# Altium project VI.595X5.V1.1.PrjPcb
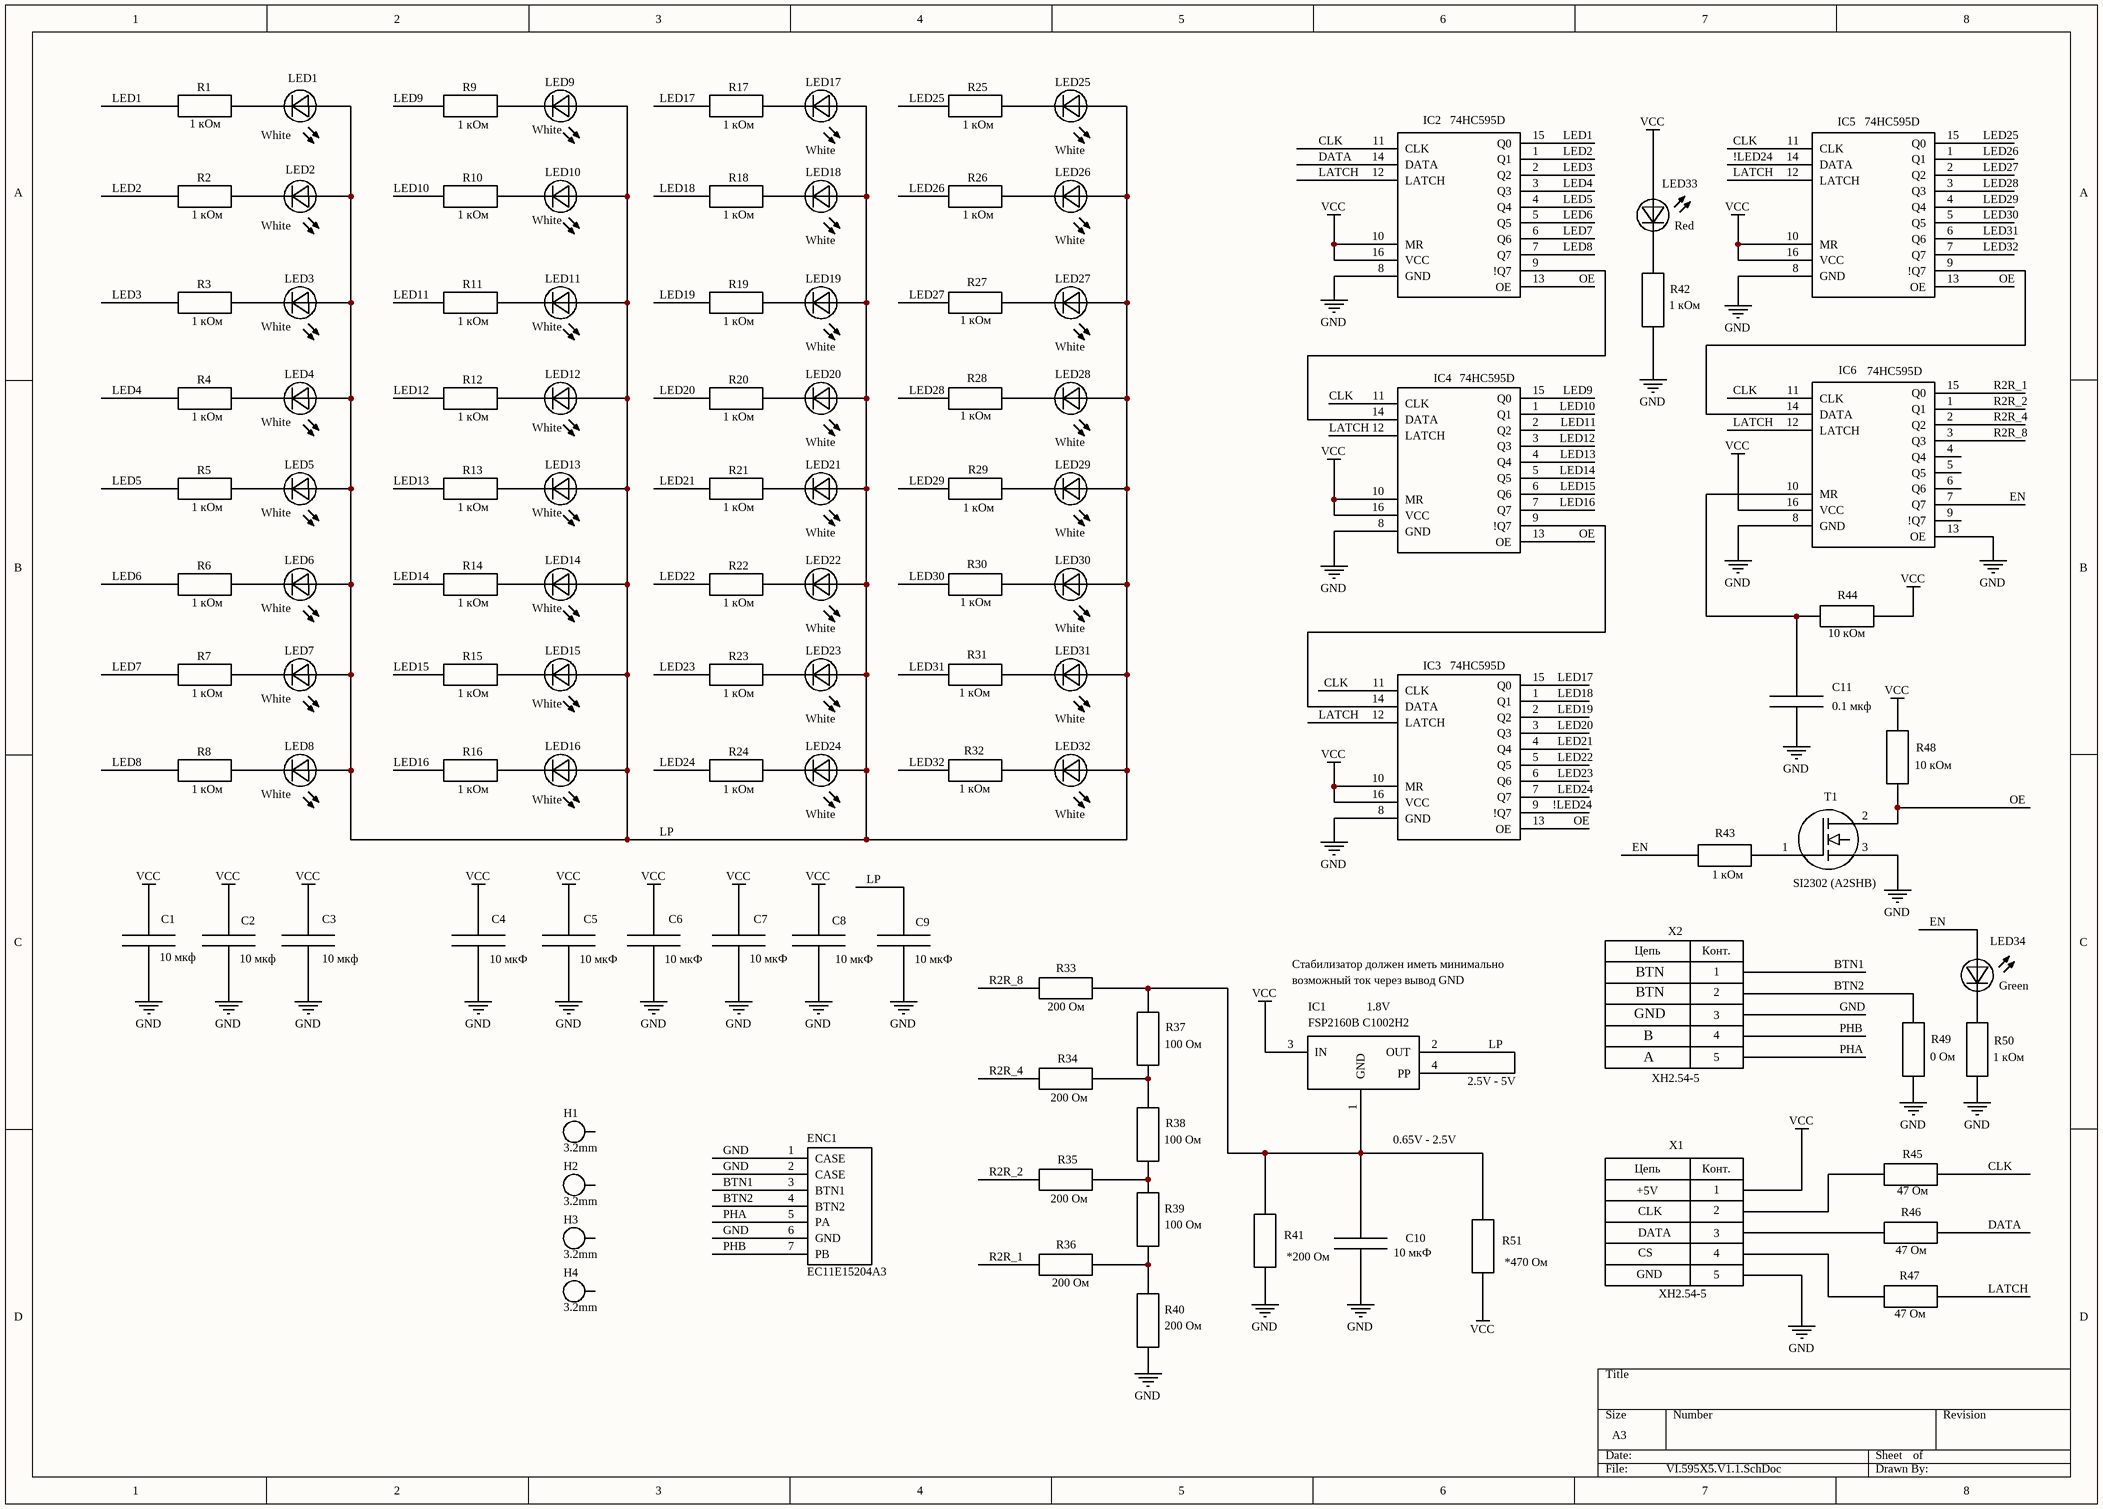
[diagram p0: VI.595X5.V1.1.SchDoc]
1 sheet, 110 parts. Net scope: global (net labels, ports and power ports of the same name join across sheets).
Board file: VI.595X5.V1.1.PcbDoc

## Sheet VI.595X5.V1.1.SchDoc: Volume_LED_indicator
size A3; Author: Sergiy_83

### Parts
C1  10 мкф  [Конденсатор SMD Case 1206]
C2  10 мкф  [Конденсатор SMD Case 1206]
C3  10 мкф  [Конденсатор SMD Case 1206]
C4  10 мкФ  [Конденсатор SMD Case 1206]
C5  10 мкФ  [Конденсатор SMD Case 1206]
C6  10 мкФ  [Конденсатор SMD Case 1206]
C7  10 мкФ  [Конденсатор SMD Case 1206]
C8  10 мкФ  [Конденсатор SMD Case 1206]
C9  10 мкФ  [Конденсатор SMD Case 1206]
C10  10 мкФ  [Конденсатор SMD Case 1206]
C11  0.1 мкф  [Конденсатор SMD Case 1206]
ENC1  EC11E15204A3  [Encoder]
H1  3.2mm  [Отверстие 3,2]
H2  3.2mm  [Отверстие 3,2]
H3  3.2mm  [Отверстие 3,2]
H4  3.2mm  [Отверстие 3,2]
IC1  FSP2160B C1002H2  [SOT-223]
IC2  74HC595D  [SO-16]
IC3  74HC595D  [SO-16]
IC4  74HC595D  [SO-16]
IC5  74HC595D  [SO-16]
IC6  74HC595D  [SO-16]
LED1  White  [Светодиод  5x2 mm]
LED2  White  [Светодиод  5x2 mm]
LED3  White  [Светодиод  5x2 mm]
LED4  White  [Светодиод  5x2 mm]
LED5  White  [Светодиод  5x2 mm]
LED6  White  [Светодиод  5x2 mm]
LED7  White  [Светодиод  5x2 mm]
LED8  White  [Светодиод  5x2 mm]
LED9  White  [Светодиод  5x2 mm]
LED10  White  [Светодиод  5x2 mm]
LED11  White  [Светодиод  5x2 mm]
LED12  White  [Светодиод  5x2 mm]
LED13  White  [Светодиод  5x2 mm]
LED14  White  [Светодиод  5x2 mm]
LED15  White  [Светодиод  5x2 mm]
LED16  White  [Светодиод  5x2 mm]
LED17  White  [Светодиод  5x2 mm]
LED18  White  [Светодиод  5x2 mm]
LED19  White  [Светодиод  5x2 mm]
LED20  White  [Светодиод  5x2 mm]
LED21  White  [Светодиод  5x2 mm]
LED22  White  [Светодиод  5x2 mm]
LED23  White  [Светодиод  5x2 mm]
LED24  White  [Светодиод  5x2 mm]
LED25  White  [Светодиод  5x2 mm]
LED26  White  [Светодиод  5x2 mm]
LED27  White  [Светодиод  5x2 mm]
LED28  White  [Светодиод  5x2 mm]
LED29  White  [Светодиод  5x2 mm]
LED30  White  [Светодиод  5x2 mm]
LED31  White  [Светодиод  5x2 mm]
LED32  White  [Светодиод  5x2 mm]
LED33  Red  [SMD 1206 Светодиод ВАЙТ]
LED34  Green  [SMD 1206 Светодиод ВАЙТ]
R1  1 кОм  [SMD 0805 Резистор]
R2  1 кОм  [SMD 0805 Резистор]
R3  1 кОм  [SMD 0805 Резистор]
R4  1 кОм  [SMD 0805 Резистор]
R5  1 кОм  [SMD 0805 Резистор]
R6  1 кОм  [SMD 0805 Резистор]
R7  1 кОм  [SMD 0805 Резистор]
R8  1 кОм  [SMD 0805 Резистор]
R9  1 кОм  [SMD 0805 Резистор]
R10  1 кОм  [SMD 0805 Резистор]
R11  1 кОм  [SMD 0805 Резистор]
R12  1 кОм  [SMD 0805 Резистор]
R13  1 кОм  [SMD 0805 Резистор]
R14  1 кОм  [SMD 0805 Резистор]
R15  1 кОм  [SMD 0805 Резистор]
R16  1 кОм  [SMD 0805 Резистор]
R17  1 кОм  [SMD 0805 Резистор]
R18  1 кОм  [SMD 0805 Резистор]
R19  1 кОм  [SMD 0805 Резистор]
R20  1 кОм  [SMD 0805 Резистор]
R21  1 кОм  [SMD 0805 Резистор]
R22  1 кОм  [SMD 0805 Резистор]
R23  1 кОм  [SMD 0805 Резистор]
R24  1 кОм  [SMD 0805 Резистор]
R25  1 кОм  [SMD 0805 Резистор]
R26  1 кОм  [SMD 0805 Резистор]
R27  1 кОм  [SMD 0805 Резистор]
R28  1 кОм  [SMD 0805 Резистор]
R29  1 кОм  [SMD 0805 Резистор]
R30  1 кОм  [SMD 0805 Резистор]
R31  1 кОм  [SMD 0805 Резистор]
R32  1 кОм  [SMD 0805 Резистор]
R33  200 Ом  [SMD 0805 Резистор]
R34  200 Ом  [SMD 0805 Резистор]
R35  200 Ом  [SMD 0805 Резистор]
R36  200 Ом  [SMD 0805 Резистор]
R37  100 Ом  [SMD 0805 Резистор]
R38  100 Ом  [SMD 0805 Резистор]
R39  100 Ом  [SMD 0805 Резистор]
R40  200 Ом  [SMD 0805 Резистор]
R41  *200 Ом  [SMD 0805 Резистор]
R42  1 кОм  [SMD 0805 Резистор]
R43  1 кОм  [SMD 0805 Резистор]
R44  10 кОм  [SMD 0805 Резистор]
R45  47 Ом  [SMD 0805 Резистор]
R46  47 Ом  [SMD 0805 Резистор]
R47  47 Ом  [SMD 0805 Резистор]
R48  10 кОм  [SMD 0805 Резистор]
R49  0 Ом  [SMD 0805 Резистор]
R50  1 кОм  [SMD 0805 Резистор]
R51  *470 Ом  [SMD 0805 Резистор]
T1  SI2302 (A2SHB)  [SMD SOT-23 Транзистор 3 pin]
X1  XH2.54-5  [(1x5)pin XH 2.54 Header]
X2  XH2.54-5  [(1x5)pin XH 2.54 Header]

### Nets
GND: C1.2(-) C2.2(-) C3.2(-) C4.2(-) C5.2(-) C6.2(-) C7.2(-) C8.2(-) C9.2(-) C10.2(-) C11.2(-) ENC1.1(CASE) ENC1.2(CASE) ENC1.6(GND) IC2.8(GND) IC3.8(GND) IC4.8(GND) IC5.8(GND) IC6.8(GND) IC6.13(OE) R40.1(left) R41.1(left) R42.1(left) R49.1(left) R50.1(left) T1.3 X1.5 X2.3
VCC: C1.1(+) C2.1(+) C3.1(+) C4.1(+) C5.1(+) C6.1(+) C7.1(+) C8.1(+) IC1.3(IN) IC2.10(MR) IC2.16(VCC) IC3.10(MR) IC3.16(VCC) IC4.10(MR) IC4.16(VCC) IC5.10(MR) IC5.16(VCC) IC6.16(VCC) LED33.1(А) R44.1(left) R48.1(left) R51.1(left) X1.1
!LED24: IC3.9(!Q7) IC5.14(DATA)
BTN1: ENC1.3(BTN1) X2.1
BTN2: ENC1.4(BTN2) R49.2(right) X2.2
CLK: IC2.11(CLK) IC3.11(CLK) IC4.11(CLK) IC5.11(CLK) IC6.11(CLK) R45.1(left)
DATA: IC2.14(DATA) R46.1(left)
EN: IC6.7(Q7) LED34.1(А) R43.2(right)
LATCH: IC2.12(LATCH) IC3.12(LATCH) IC4.12(LATCH) IC5.12(LATCH) IC6.12(LATCH) R47.1(left)
LED1: IC2.15(Q0) R1.1(left)
LED2: IC2.1(Q1) R2.1(left)
LED3: IC2.2(Q2) R3.1(left)
LED4: IC2.3(Q3) R4.1(left)
LED5: IC2.4(Q4) R5.1(left)
LED6: IC2.5(Q5) R6.1(left)
LED7: IC2.6(Q6) R7.1(left)
LED8: IC2.7(Q7) R8.1(left)
LED9: IC4.15(Q0) R9.1(left)
LED10: IC4.1(Q1) R10.1(left)
LED11: IC4.2(Q2) R11.1(left)
LED12: IC4.3(Q3) R12.1(left)
LED13: IC4.4(Q4) R13.1(left)
LED14: IC4.5(Q5) R14.1(left)
LED15: IC4.6(Q6) R15.1(left)
LED16: IC4.7(Q7) R16.1(left)
LED17: IC3.15(Q0) R17.1(left)
LED18: IC3.1(Q1) R18.1(left)
LED19: IC3.2(Q2) R19.1(left)
LED20: IC3.3(Q3) R20.1(left)
LED21: IC3.4(Q4) R21.1(left)
LED22: IC3.5(Q5) R22.1(left)
LED23: IC3.6(Q6) R23.1(left)
LED24: IC3.7(Q7) R24.1(left)
LED25: IC5.15(Q0) R25.1(left)
LED26: IC5.1(Q1) R26.1(left)
LED27: IC5.2(Q2) R27.1(left)
LED28: IC5.3(Q3) R28.1(left)
LED29: IC5.4(Q4) R29.1(left)
LED30: IC5.5(Q5) R30.1(left)
LED31: IC5.6(Q6) R31.1(left)
LED32: IC5.7(Q7) R32.1(left)
LP: C9.1(+) IC1.2(OUT) IC1.4(PP) LED1.1(А) LED2.1(А) LED3.1(А) LED4.1(А) LED5.1(А) LED6.1(А) LED7.1(А) LED8.1(А) LED9.1(А) LED10.1(А) LED11.1(А) LED12.1(А) LED13.1(А) LED14.1(А) LED15.1(А) LED16.1(А) LED17.1(А) LED18.1(А) LED19.1(А) LED20.1(А) LED21.1(А) LED22.1(А) LED23.1(А) LED24.1(А) LED25.1(А) LED26.1(А) LED27.1(А) LED28.1(А) LED29.1(А) LED30.1(А) LED31.1(А) LED32.1(А)
OE: IC2.13(OE) IC3.13(OE) IC4.13(OE) IC5.13(OE) R48.2(right) T1.2
PHA: ENC1.5(PA) X2.5
PHB: ENC1.7(PB) X2.4
R2R_1: IC6.15(Q0) R36.1(left)
R2R_2: IC6.1(Q1) R35.1(left)
R2R_4: IC6.2(Q2) R34.1(left)
R2R_8: IC6.3(Q3) R33.1(left)
NetC10_1: C10.1(+) IC1.1(GND) R33.2(right) R37.2(right) R41.2(right) R51.2(right)
NetC11_1: C11.1(+) IC6.10(MR) R44.2(right)
NetIC2_9: IC2.9(!Q7) IC4.14(DATA)
NetIC3_14: IC3.14(DATA) IC4.9(!Q7)
NetIC5_9: IC5.9(!Q7) IC6.14(DATA)
NetLED1_2: LED1.2(K) R1.2(right)
NetLED2_2: LED2.2(K) R2.2(right)
NetLED3_2: LED3.2(K) R3.2(right)
NetLED4_2: LED4.2(K) R4.2(right)
NetLED5_2: LED5.2(K) R5.2(right)
NetLED6_2: LED6.2(K) R6.2(right)
NetLED7_2: LED7.2(K) R7.2(right)
NetLED8_2: LED8.2(K) R8.2(right)
NetLED9_2: LED9.2(K) R9.2(right)
NetLED10_2: LED10.2(K) R10.2(right)
NetLED11_2: LED11.2(K) R11.2(right)
NetLED12_2: LED12.2(K) R12.2(right)
NetLED13_2: LED13.2(K) R13.2(right)
NetLED14_2: LED14.2(K) R14.2(right)
NetLED15_2: LED15.2(K) R15.2(right)
NetLED16_2: LED16.2(K) R16.2(right)
NetLED17_2: LED17.2(K) R17.2(right)
NetLED18_2: LED18.2(K) R18.2(right)
NetLED19_2: LED19.2(K) R19.2(right)
NetLED20_2: LED20.2(K) R20.2(right)
NetLED21_2: LED21.2(K) R21.2(right)
NetLED22_2: LED22.2(K) R22.2(right)
NetLED23_2: LED23.2(K) R23.2(right)
NetLED24_2: LED24.2(K) R24.2(right)
NetLED25_2: LED25.2(K) R25.2(right)
NetLED26_2: LED26.2(K) R26.2(right)
NetLED27_2: LED27.2(K) R27.2(right)
NetLED28_2: LED28.2(K) R28.2(right)
NetLED29_2: LED29.2(K) R29.2(right)
NetLED30_2: LED30.2(K) R30.2(right)
NetLED31_2: LED31.2(K) R31.2(right)
NetLED32_2: LED32.2(K) R32.2(right)
NetLED33_2: LED33.2(K) R42.2(right)
NetLED34_2: LED34.2(K) R50.2(right)
NetR34_2: R34.2(right) R37.1(left) R38.2(right)
NetR35_2: R35.2(right) R38.1(left) R39.2(right)
NetR36_2: R36.2(right) R39.1(left) R40.2(right)
NetR43_1: R43.1(left) T1.1
NetR45_2: R45.2(right) X1.2
NetR46_2: R46.2(right) X1.3
NetR47_2: R47.2(right) X1.4

Not connected (* = marked no-connect by the designer): H1 1; H2 1; H3 1; H4 1; IC6 4(Q4) 5(Q5) 6(Q6) 9(!Q7)

### Notes on the sheet
- Стабилизатор должен иметь минимально
- возможный ток через вывод GND
- BTN
- (near IC1) 1.8V
- GND
- B
- (near IC1) 2.5V - 5V
- A
- (near IC1) 0.65V - 2.5V
- +5V
- CLK
- DATA
- CS
- (in symbol (1x5) pin 2.54 Header) Цепь; Конт.

### Library data of the parts
C1-C11 = Конденсатор: Case: SMD 1206
  C1-C3: Value: 10 мкф
  C4-C10: Value: 10 мкФ
  C11: Value: 0.1 мкф
ENC1 = Encoder_01: Value: EC11E15204A3; Case: -
H1-H4 = Отверстие монтажное: Value: 3.2mm
IC1 = FSP2160B J1003H1: Value: FSP2160B C1002H2; Case: SOT-223
LED1-LED34 = Светодиод
  LED1-LED32: Value: White; Case: 5x2x6
  LED33: Value: Red; Case: SMD 1206
  LED34: Value: Green; Case: SMD 1206
R1-R51 = Резистор: Case: SMD 0805
  R1-R32 R42 R43 R50: Value: 1 кОм
  R33-R36 R40: Value: 200 Ом
  R37-R39: Value: 100 Ом
  R41: Value: *200 Ом
  R44 R48: Value: 10 кОм
  R45-R47: Value: 47 Ом
  R49: Value: 0 Ом
  R51: Value: *470 Ом
T1 = Транзистор MOSFET N-конал (как n-p-n): Value: SI2302 (A2SHB); Case: SOT-23
X1 X2 = (1x5) pin 2.54 Header: Value: XH2.54-5; Case: XH2.54-5
IC2-IC6 = 74HC595D: Value: 74HC595D; Case: SO-16